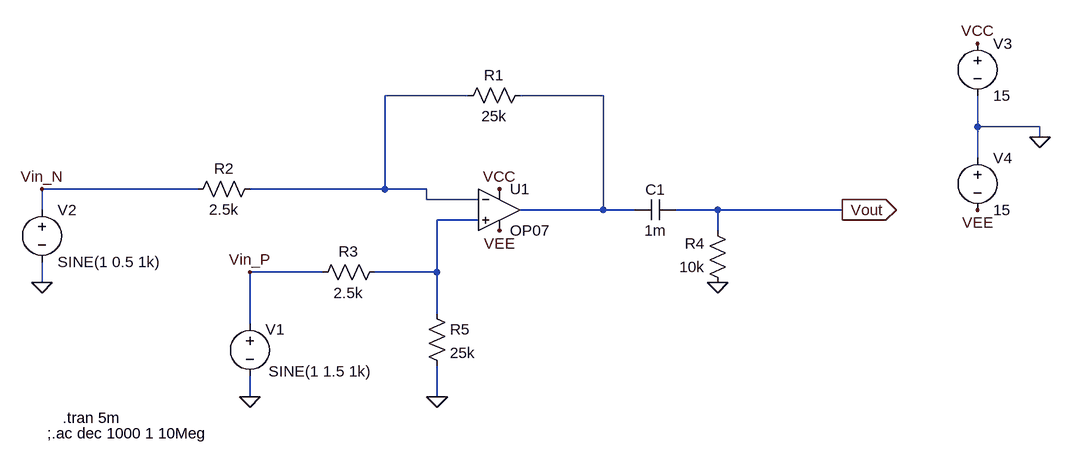
[diagram p0: schematic OPamp_subtractor.asc]
OPamp_subtractor.asc, the LTspice schematic file:
Version 4
SHEET 1 1060 680
WIRE 160 -208 32 -208
WIRE 368 -208 240 -208
WIRE 944 -160 944 -208
WIRE 1040 -160 944 -160
WIRE 1040 -144 1040 -160
WIRE 944 -112 944 -160
WIRE -256 -64 -496 -64
WIRE 32 -64 32 -208
WIRE 32 -64 -176 -64
WIRE 96 -64 32 -64
WIRE 96 -48 96 -64
WIRE 176 -48 96 -48
WIRE -496 -32 -496 -64
WIRE 368 -32 368 -208
WIRE 368 -32 240 -32
WIRE 416 -32 368 -32
WIRE 544 -32 480 -32
WIRE 736 -32 544 -32
WIRE 176 -16 112 -16
WIRE 544 0 544 -32
WIRE -64 64 -176 64
WIRE 112 64 112 -16
WIRE 112 64 16 64
WIRE -496 80 -496 48
WIRE 112 128 112 64
WIRE -176 144 -176 64
WIRE -176 256 -176 224
WIRE 112 256 112 208
FLAG 736 -32 Vout
IOPIN 736 -32 Out
FLAG 1040 -144 0
FLAG 944 -288 VCC
FLAG 208 -64 VCC
FLAG 944 -32 VEE
FLAG 208 0 VEE
FLAG -496 80 0
FLAG -176 256 0
FLAG 112 256 0
FLAG 544 80 0
FLAG -496 -64 Vin_N
FLAG -176 64 Vin_P
SYMBOL res 256 -224 R90
WINDOW 0 0 56 VBottom 2
WINDOW 3 32 56 VTop 2
SYMATTR InstName R1
SYMATTR Value 25k
SYMBOL res -160 -80 R90
WINDOW 0 0 56 VBottom 2
WINDOW 3 32 56 VTop 2
SYMATTR InstName R2
SYMATTR Value 2.5k
SYMBOL res 32 48 R90
WINDOW 0 0 56 VBottom 2
WINDOW 3 32 56 VTop 2
SYMATTR InstName R3
SYMATTR Value 2.5k
SYMBOL voltage -176 128 R0
WINDOW 0 24 24 Left 2
WINDOW 3 29 89 Left 2
WINDOW 123 0 0 Left 0
WINDOW 39 0 0 Left 0
SYMATTR InstName V1
SYMATTR Value SINE(1 1.5 1k)
SYMBOL voltage -496 -48 R0
WINDOW 123 0 0 Left 0
WINDOW 39 0 0 Left 0
SYMATTR InstName V2
SYMATTR Value SINE(1 0.5 1k)
SYMBOL Opamps\\OP07 208 -96 R0
SYMATTR InstName U1
SYMBOL voltage 944 -304 R0
WINDOW 123 0 0 Left 0
WINDOW 39 0 0 Left 0
SYMATTR InstName V3
SYMATTR Value 15
SYMBOL voltage 944 -128 R0
WINDOW 123 0 0 Left 0
WINDOW 39 0 0 Left 0
SYMATTR InstName V4
SYMATTR Value 15
SYMBOL res 560 96 R180
WINDOW 0 36 76 Left 2
WINDOW 3 36 40 Left 2
SYMATTR InstName R4
SYMATTR Value 10k
SYMBOL cap 480 -48 R90
WINDOW 0 0 32 VBottom 2
WINDOW 3 32 32 VTop 2
SYMATTR InstName C1
SYMATTR Value 1m
SYMBOL res 96 112 R0
SYMATTR InstName R5
SYMATTR Value 25k
TEXT -464 288 Left 2 !.tran 5m
TEXT -488 312 Left 2 !;.ac dec 1000 1 10Meg

The netlist it stands for:
* OPamp_subtractor.asc
R1 N002 N001 25k
R2 N001 Vin_N 2.5k
R3 N003 Vin_P 2.5k
V1 Vin_P 0 SINE(1 1.5 1k)
V2 Vin_N 0 SINE(1 0.5 1k)
XU1 N003 N001 VCC VEE N002 LT1001  ; OP07, pins In+ In- V+ V- OUT
V3 VCC 0 15
V4 0 VEE 15
R4 0 Vout 10k
C1 Vout N002 1m
R5 N003 0 25k
.tran 5m
;.ac dec 1000 1 10Meg
.lib LTC.lib
.backanno
.end